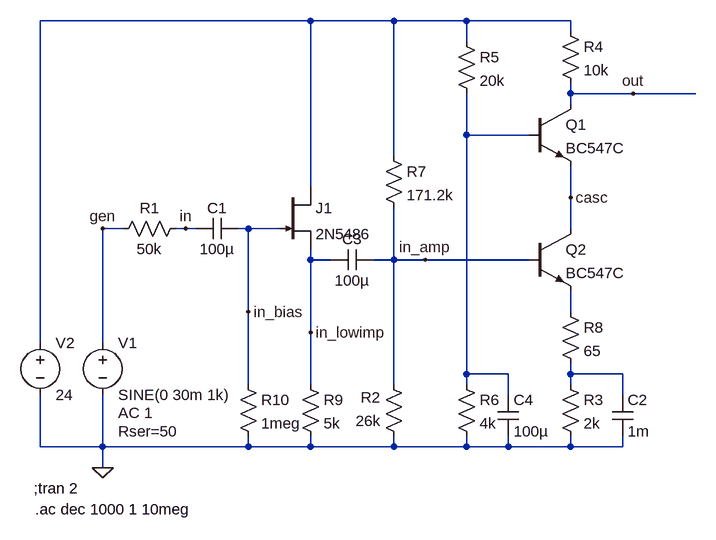
[diagram p0: schematic amp_labor2.asc]
amp_labor2.asc, the LTspice schematic file:
Version 4
SHEET 1 880 680
WIRE -32 -256 -448 -256
WIRE 96 -256 -32 -256
WIRE 208 -256 96 -256
WIRE 368 -256 208 -256
WIRE 368 -240 368 -256
WIRE 208 -224 208 -256
WIRE 368 -144 368 -160
WIRE 464 -144 368 -144
WIRE 560 -144 464 -144
WIRE 368 -128 368 -144
WIRE 208 -80 208 -144
WIRE 304 -80 208 -80
WIRE 96 -48 96 -256
WIRE -32 0 -32 -256
WIRE 368 16 368 -32
WIRE -320 64 -352 64
WIRE -224 64 -240 64
WIRE -208 64 -224 64
WIRE -128 64 -144 64
WIRE -80 64 -128 64
WIRE 368 64 368 16
WIRE -32 112 -32 96
WIRE 0 112 -32 112
WIRE 96 112 96 32
WIRE 96 112 64 112
WIRE 144 112 96 112
WIRE 304 112 144 112
WIRE -128 192 -128 64
WIRE 368 192 368 160
WIRE -32 224 -32 112
WIRE -448 240 -448 -256
WIRE -352 240 -352 64
WIRE 208 288 208 -80
WIRE 272 288 208 288
WIRE 368 288 368 272
WIRE 448 288 368 288
WIRE -128 304 -128 192
WIRE -32 304 -32 224
WIRE 96 304 96 112
WIRE 208 304 208 288
WIRE 368 304 368 288
WIRE 272 320 272 288
WIRE 448 320 448 288
WIRE -448 400 -448 320
WIRE -352 400 -352 320
WIRE -352 400 -448 400
WIRE -128 400 -128 384
WIRE -128 400 -352 400
WIRE -32 400 -32 384
WIRE -32 400 -128 400
WIRE 96 400 96 384
WIRE 96 400 -32 400
WIRE 208 400 208 384
WIRE 208 400 96 400
WIRE 272 400 272 384
WIRE 272 400 208 400
WIRE 368 400 368 384
WIRE 368 400 272 400
WIRE 448 400 448 384
WIRE 448 400 368 400
WIRE -352 432 -352 400
FLAG -352 432 0
FLAG 464 -144 out
FLAG -224 64 in
FLAG -128 192 in_bias
FLAG -32 224 in_lowimp
FLAG 144 112 in_amp
FLAG -352 64 gen
FLAG 368 16 casc
SYMBOL voltage -352 224 R0
WINDOW 123 24 124 Left 2
WINDOW 39 24 152 Left 2
SYMATTR InstName V1
SYMATTR Value SINE(0 30m 1k)
SYMATTR Value2 AC 1
SYMATTR SpiceLine Rser=50
SYMBOL voltage -448 224 R0
WINDOW 123 0 0 Left 2
WINDOW 39 0 0 Left 2
SYMATTR InstName V2
SYMATTR Value 24
SYMBOL res -336 80 R270
WINDOW 0 32 56 VTop 2
WINDOW 3 0 56 VBottom 2
SYMATTR InstName R1
SYMATTR Value 50k
SYMBOL cap -208 80 R270
WINDOW 0 32 32 VTop 2
WINDOW 3 0 32 VBottom 2
SYMATTR InstName C1
SYMATTR Value 100µ
SYMBOL res 352 288 R0
SYMATTR InstName R3
SYMATTR Value 2k
SYMBOL res 352 -256 R0
SYMATTR InstName R4
SYMATTR Value 10k
SYMBOL res 192 -240 R0
SYMATTR InstName R5
SYMATTR Value 20k
SYMBOL res 192 288 R0
SYMATTR InstName R6
SYMATTR Value 4k
SYMBOL cap 432 320 R0
SYMATTR InstName C2
SYMATTR Value 1m
SYMBOL npn 304 -128 R0
SYMATTR InstName Q1
SYMATTR Value BC547C
SYMBOL npn 304 64 R0
SYMATTR InstName Q2
SYMATTR Value BC547C
SYMBOL res 112 400 R180
WINDOW 0 36 76 Left 2
WINDOW 3 36 40 Left 2
SYMATTR InstName R2
SYMATTR Value 26k
SYMBOL res 80 -64 R0
SYMATTR InstName R7
SYMATTR Value 171.2k
SYMBOL res 352 176 R0
SYMATTR InstName R8
SYMATTR Value 65
SYMBOL njf -80 0 R0
SYMATTR InstName J1
SYMATTR Value 2N5486
SYMBOL res -48 288 R0
SYMATTR InstName R9
SYMATTR Value 5k
SYMBOL res -144 288 R0
SYMATTR InstName R10
SYMATTR Value 1meg
SYMBOL cap 0 128 R270
WINDOW 0 32 32 VTop 2
WINDOW 3 0 32 VBottom 2
SYMATTR InstName C3
SYMATTR Value 100µ
SYMBOL cap 256 320 R0
SYMATTR InstName C4
SYMATTR Value 100µ
TEXT -458 464 Left 2 !;tran 2
TEXT -456 496 Left 2 !.ac dec 1000 1 10meg

The netlist it stands for:
* amp_labor2.asc
V1 gen 0 SINE(0 30m 1k) AC 1 Rser=50
V2 N001 0 24
R1 gen in 50k
C1 in in_bias 100µ
R3 N004 0 2k
R4 N001 out 10k
R5 N001 N002 20k
R6 N002 0 4k
C2 N004 0 1m
Q1 out N002 casc 0 BC547C
Q2 casc in_amp N003 0 BC547C
R2 0 in_amp 26k
R7 N001 in_amp 171.2k
R8 N003 N004 65
J1 N001 in_bias in_lowimp 2N5486
R9 in_lowimp 0 5k
R10 in_bias 0 1meg
C3 in_lowimp in_amp 100µ
C4 N002 0 100µ
.model NPN NPN
.model PNP PNP
.lib standard.bjt
.model NJF NJF
.model PJF PJF
.lib standard.jft
;tran 2
.ac dec 1000 1 10meg
.backanno
.end